# EAGLE schematic aecho (EAGLE 7.7.0)
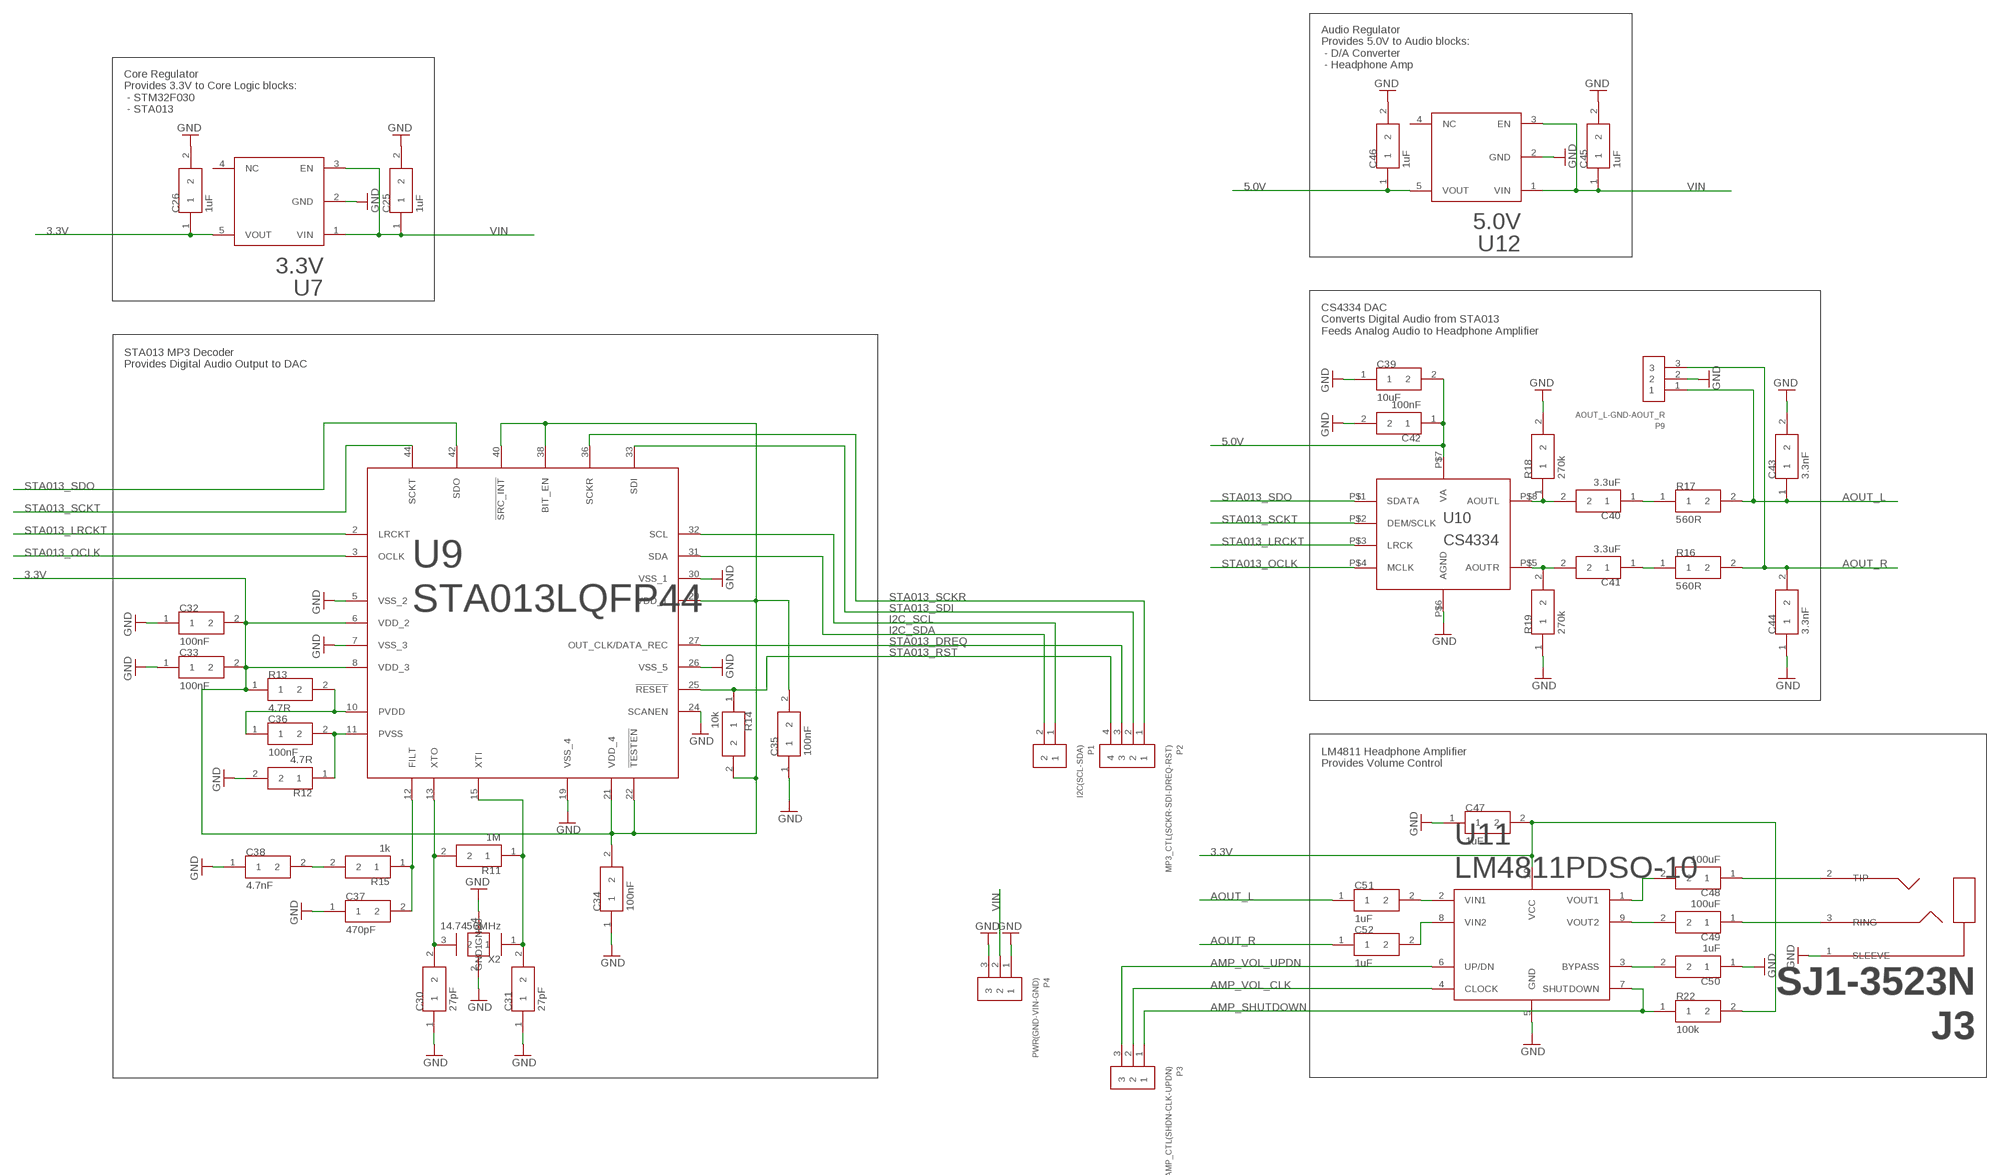
[diagram p0: schematic, sheet 1]

## Parts
C25  1uF  CAP0805  [0805]
C26  1uF  CAP0805  [0805]
C30  27pF  CAP0805  [0805]
C31  27pF  CAP0805  [0805]
C32  100nF  CAP0805  [0805]
C33  100nF  CAP0805  [0805]
C34  100nF  CAP0805  [0805]
C35  100nF  CAP0805  [0805]
C36  100nF  CAP0805  [0805]
C37  470pF  CAP0805  [0805]
C38  4.7nF  CAP0805  [0805]
C39  10uF  CAP0805  [0805]
C40  3.3uF  CAP0805  [0805]
C41  3.3uF  CAP0805  [0805]
C42  100nF  CAP0805  [0805]
C43  3.3nF  CAP0805  [0805]
C44  3.3nF  CAP0805  [0805]
C45  1uF  CAP0805  [0805]
C46  1uF  CAP0805  [0805]
C47  1uF  CAP0805  [0805]
C48  100uF  CAP1210  [1210]
C49  100uF  CAP1210  [1210]
C50  1uF  CAP0805  [0805]
C51  1uF  CAP0805  [0805]
C52  1uF  CAP0805  [0805]
J3  SJ1-3523N  [SJ1-352XN]
P1  I2C(SCL-SDA)  PIN_2  [PIN_2]
P2  MP3_CTL(SCKR-SDI-DREQ-RST)  PIN_4  [PIN_4]
P3  AMP_CTL(SHDN-CLK-UPDN)  PIN_3  [PIN_3]
P4  PWR(GND-VIN-GND)  PIN_3  [PIN_3]
P9  AOUT_L-GND-AOUT_R  PIN_3  [PIN_3]
R11  1M  RES0805  [0805]
R12  4.7R  RES0805  [0805]
R13  4.7R  RES0805  [0805]
R14  10k  RES0805  [0805]
R15  1k  RES0805  [0805]
R16  560R  RES0805  [0805]
R17  560R  RES0805  [0805]
R18  270k  RES0805  [0805]
R19  270k  RES0805  [0805]
R22  100k  RES0805  [0805]
U7  3.3V  LP3985SOT23-5  [SOT23-5]
U9  STA013LQFP44  [QFP44]
U10  CS4334  [SO8]
U11  LM4811PDSO-10  [PDSO-10]
U12  5.0V  LP3985SOT23-5  [SOT23-5]
X2  14.7456MHz  XTAL_GNDSMD_3225  [XTAL_3225]

## Nets
3.3V: C26.1 C32.2 C33.2 C34.2 C35.2 C47.2 R13.1 R14.2 R22.2 U7.5(VOUT) U9.6(VDD_2) U9.8(VDD_3) U9.21(VDD_4) U9.22(!TESTEN) U9.29(VDD_1) U9.38(BIT_EN) U9.40(!SRC_INT) U11.10(VCC)
5.0V: C39.2 C42.1 C46.1 U10.P$7(VA) U12.5(VOUT)
!STA013_RST: P2.4 R14.1 U9.25(!RESET)
AMP_SHUTDOWN: P3.1 R22.1 U11.7(SHUTDOWN)
AMP_VOL_CLK: P3.2 U11.4(CLOCK)
AMP_VOL_UPDN: P3.3 U11.6(UP/DN)
AOUT_L: C43.1 C51.1 P9.1 R17.2
AOUT_R: C44.2 C52.1 P9.3 R16.2
GND: C25.2 C26.2 C30.1 C31.1 C32.1 C33.1 C34.1 C35.1 C37.1 C38.1 C39.1 C42.2 C43.2 C44.1 C45.2 C46.2 C47.1 C50.1 J3.1(SLEEVE) P4.1 P4.3 P9.2 R12.2 R18.2 R19.1 U7.2(GND) U9.5(VSS_2) U9.7(VSS_3) U9.19(VSS_4) U9.24(SCANEN) U9.26(VSS_5) U9.30(VSS_1) U10.P$6(AGND) U11.5(GND) U12.2(GND) X2.2(GND0) X2.4(GND1)
I2C_SCL: P1.1 U9.32(SCL)
I2C_SDA: P1.2 U9.31(SDA)
N$2: C31.2 R11.1 U9.15(XTI) X2.1
N$3: C30.2 R11.2 U9.13(XTO) X2.3
N$6: C36.1 R13.2 U9.10(PVDD)
N$7: C36.2 R12.1 U9.11(PVSS)
N$8: C48.1 J3.2(TIP)
N$9: C38.2 R15.2
N$10: C40.2 R18.1 U10.P$8(AOUTL)
N$11: C37.2 R15.1 U9.12(FILT)
N$12: C41.2 R19.2 U10.P$5(AOUTR)
N$28: C41.1 R16.1
N$29: C40.1 R17.1
N$30: C48.2 U11.1(VOUT1)
N$31: C49.2 U11.9(VOUT2)
N$32: C50.2 U11.3(BYPASS)
N$34: C49.1 J3.3(RING)
N$39: C51.2 U11.2(VIN1)
N$40: C52.2 U11.8(VIN2)
STA013_DREQ: P2.3 U9.27(OUT_CLK/DATA_REC)
STA013_LRCKT: U9.2(LRCKT) U10.P$3(LRCK)
STA013_OCLK: U9.3(OCLK) U10.P$4(MCLK)
STA013_SCKR: P2.1 U9.36(SCKR)
STA013_SCKT: U9.44(SCKT) U10.P$2(DEM/SCLK)
STA013_SDI: P2.2 U9.33(SDI)
STA013_SDO: U9.42(SDO) U10.P$1(SDATA)
VIN: C25.1 C45.1 P4.2 U7.1(VIN) U7.3(EN) U12.1(VIN) U12.3(EN)
Unconnected: U7.4(NC) U12.4(NC)

## Notes on the sheet
- Audio Regulator
  Provides 5.0V to Audio blocks:
   - D/A Converter
   - Headphone Amp
- Core Regulator
  Provides 3.3V to Core Logic blocks:
   - STM32F030
   - STA013
- CS4334 DAC
  Converts Digital Audio from STA013
  Feeds Analog Audio to Headphone Amplifier
- STA013 MP3 Decoder
  Provides Digital Audio Output to DAC
- LM4811 Headphone Amplifier
  Provides Volume Control

## Library data of the parts
C25 C26 C30-C52 = dooba:CAP
J3 = dooba:SJ1-3523N
P1 = dooba:PIN_2
P2 = dooba:PIN_4
P3 P4 P9 = dooba:PIN_3
R11-R19 R22 = dooba:RES
U7 U12 = dooba:LP3985
U9 = dooba:STA013
U10 = dooba:CS4334
U11 = dooba:LM4811
X2 = dooba:XTAL_GND